# Altium schematic sheet SlowChans.SchDoc
size 594 x 420 mm; Address1: Address1; Address2: Address2; Address3: Address3; Address4: Address4; SheetNumber: 1; Scale: 1:1; Разраб.: Иванов; Обозначение документа: АБВГ.123456.001 Э3; Пров.: Петров; Утв.: Сидоров; Наименование организации: ОАО "Концерн "МПО-Гидроприбор"; Перв. применение: АБВГ.123456.000; Наименование изделия 1: Плата; Наименование изделия 2: Схема электрическая; Наименование изделия 3: принципиальная; Нач. отд.: Нач. отд.; Фамилия нач. отд.: Сидоров
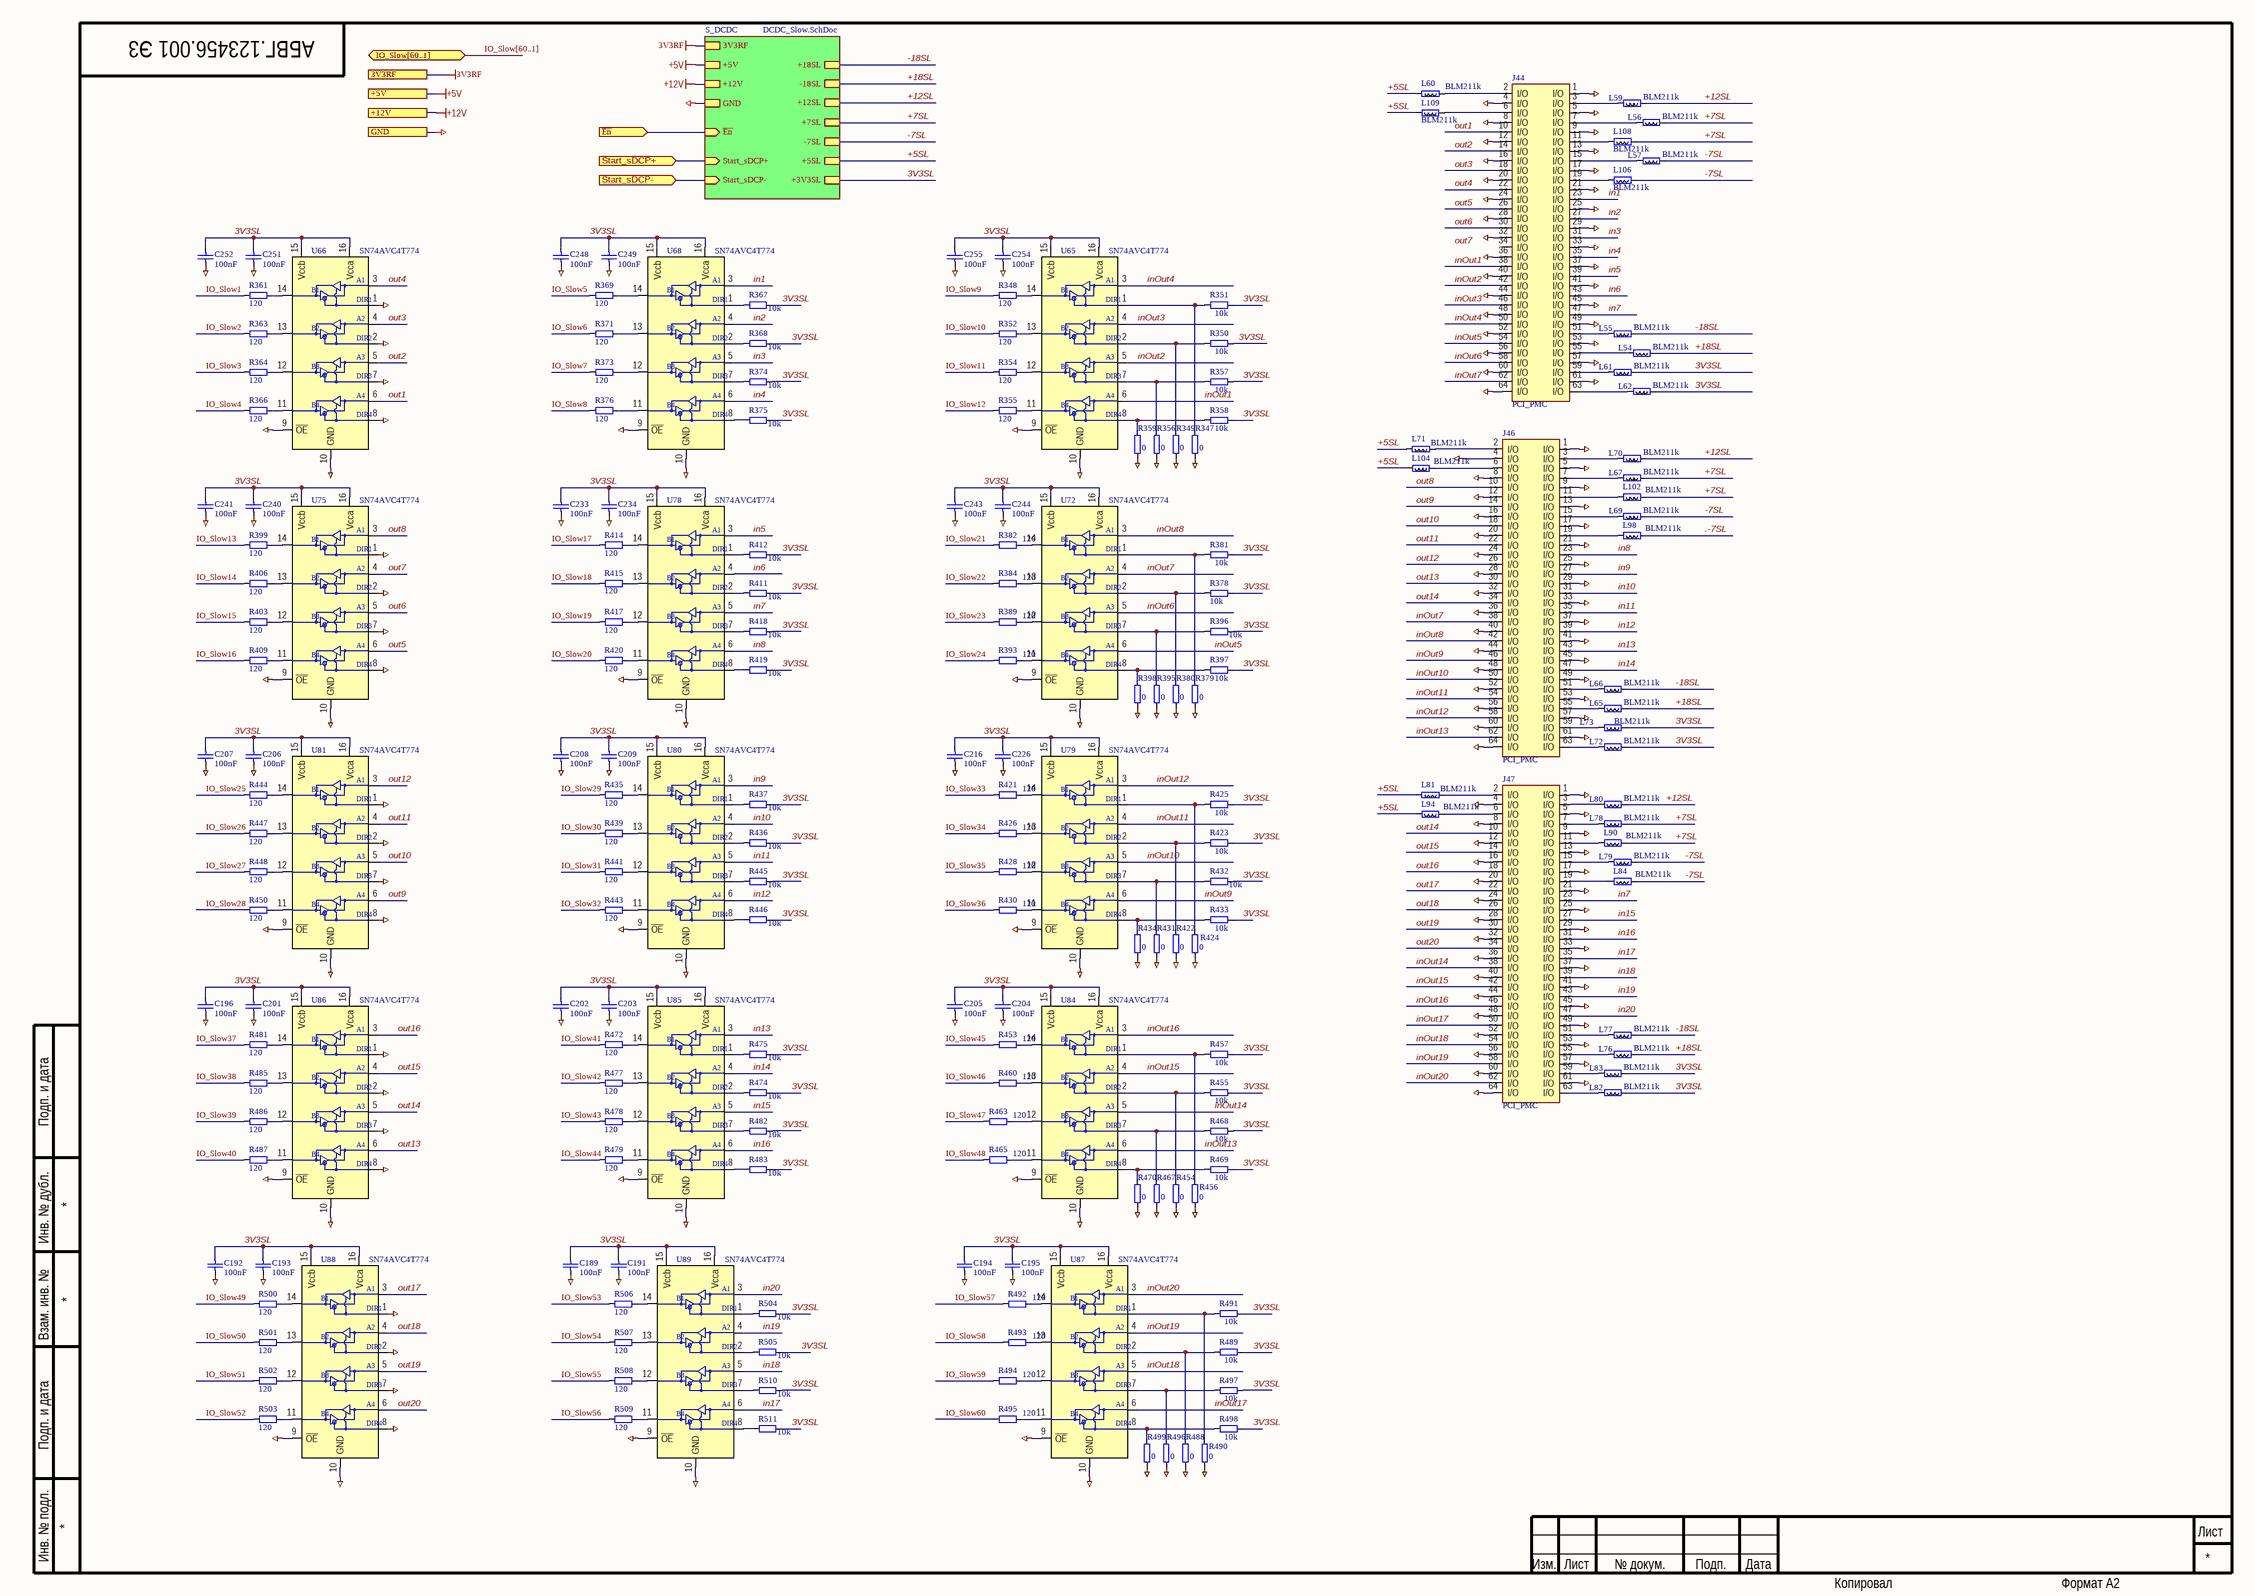
[diagram p0: SlowChans.SchDoc]

## Parts
C189  100nF  [SMD0805CAP]
C191  100nF  [SMD0805CAP]
C192  100nF  [SMD0805CAP]
C193  100nF  [SMD0805CAP]
C194  100nF  [SMD0805CAP]
C195  100nF  [SMD0805CAP]
C196  100nF  [SMD0805CAP]
C201  100nF  [SMD0805CAP]
C202  100nF  [SMD0805CAP]
C203  100nF  [SMD0805CAP]
C204  100nF  [SMD0805CAP]
C205  100nF  [SMD0805CAP]
C206  100nF  [SMD0805CAP]
C207  100nF  [SMD0805CAP]
C208  100nF  [SMD0805CAP]
C209  100nF  [SMD0805CAP]
C216  100nF  [SMD0805CAP]
C226  100nF  [SMD0805CAP]
C233  100nF  [SMD0805CAP]
C234  100nF  [SMD0805CAP]
C240  100nF  [SMD0805CAP]
C241  100nF  [SMD0805CAP]
C243  100nF  [SMD0805CAP]
C244  100nF  [SMD0805CAP]
C248  100nF  [SMD0805CAP]
C249  100nF  [SMD0805CAP]
C251  100nF  [SMD0805CAP]
C252  100nF  [SMD0805CAP]
C254  100nF  [SMD0805CAP]
C255  100nF  [SMD0805CAP]
J44  PCI_PMC  [TYCO_120521-1]
J46  PCI_PMC  [TYCO_120521-1]
J47  PCI_PMC  [TYCO_120521-1]
L54  BLM211k  [RESC2012X50N]
L55  BLM211k  [RESC2012X50N]
L56  BLM211k  [RESC2012X50N]
L57  BLM211k  [RESC2012X50N]
L59  BLM211k  [RESC2012X50N]
L60  BLM211k  [RESC2012X50N]
L61  BLM211k  [RESC2012X50N]
L62  BLM211k  [RESC2012X50N]
L65  BLM211k  [RESC2012X50N]
L66  BLM211k  [RESC2012X50N]
L67  BLM211k  [RESC2012X50N]
L69  BLM211k  [RESC2012X50N]
L70  BLM211k  [RESC2012X50N]
L71  BLM211k  [RESC2012X50N]
L72  BLM211k  [RESC2012X50N]
L73  BLM211k  [RESC2012X50N]
L76  BLM211k  [RESC2012X50N]
L77  BLM211k  [RESC2012X50N]
L78  BLM211k  [RESC2012X50N]
L79  BLM211k  [RESC2012X50N]
L80  BLM211k  [RESC2012X50N]
L81  BLM211k  [RESC2012X50N]
L82  BLM211k  [RESC2012X50N]
L83  BLM211k  [RESC2012X50N]
L84  BLM211k  [RESC2012X50N]
L90  BLM211k  [RESC2012X50N]
L94  BLM211k  [RESC2012X50N]
L98  BLM211k  [RESC2012X50N]
L102  BLM211k  [RESC2012X50N]
L104  BLM211k  [RESC2012X50N]
L106  BLM211k  [RESC2012X50N]
L108  BLM211k  [RESC2012X50N]
L109  BLM211k  [RESC2012X50N]
R347  0  [SMD0805RES]
R348  120  [SMD0805RES]
R349  0  [SMD0805RES]
R350  10k  [SMD0805RES]
R351  10k  [SMD0805RES]
R352  120  [SMD0805RES]
R354  120  [SMD0805RES]
R355  120  [SMD0805RES]
R356  0  [SMD0805RES]
R357  10k  [SMD0805RES]
R358  10k  [SMD0805RES]
R359  0  [SMD0805RES]
R361  120  [SMD0805RES]
R363  120  [SMD0805RES]
R364  120  [SMD0805RES]
R366  120  [SMD0805RES]
R367  10k  [SMD0805RES]
R368  10k  [SMD0805RES]
R369  120  [SMD0805RES]
R371  120  [SMD0805RES]
R373  120  [SMD0805RES]
R374  10k  [SMD0805RES]
R375  10k  [SMD0805RES]
R376  120  [SMD0805RES]
R378  10k  [SMD0805RES]
R379  0  [SMD0805RES]
R380  0  [SMD0805RES]
R381  10k  [SMD0805RES]
R382  120  [SMD0805RES]
R384  120  [SMD0805RES]
R389  120  [SMD0805RES]
R393  120  [SMD0805RES]
R395  0  [SMD0805RES]
R396  10k  [SMD0805RES]
R397  10k  [SMD0805RES]
R398  0  [SMD0805RES]
R399  120  [SMD0805RES]
R403  120  [SMD0805RES]
R406  120  [SMD0805RES]
R409  120  [SMD0805RES]
R411  10k  [SMD0805RES]
R412  10k  [SMD0805RES]
R414  120  [SMD0805RES]
R415  120  [SMD0805RES]
R417  120  [SMD0805RES]
R418  10k  [SMD0805RES]
R419  10k  [SMD0805RES]
R420  120  [SMD0805RES]
R421  120  [SMD0805RES]
R422  0  [SMD0805RES]
R423  10k  [SMD0805RES]
R424  0  [SMD0805RES]
R425  10k  [SMD0805RES]
R426  120  [SMD0805RES]
R428  120  [SMD0805RES]
R430  120  [SMD0805RES]
R431  0  [SMD0805RES]
R432  10k  [SMD0805RES]
R433  10k  [SMD0805RES]
R434  0  [SMD0805RES]
R435  120  [SMD0805RES]
R436  10k  [SMD0805RES]
R437  10k  [SMD0805RES]
R439  120  [SMD0805RES]
R441  120  [SMD0805RES]
R443  120  [SMD0805RES]
R444  120  [SMD0805RES]
R445  10k  [SMD0805RES]
R446  10k  [SMD0805RES]
R447  120  [SMD0805RES]
R448  120  [SMD0805RES]
R450  120  [SMD0805RES]
R453  120  [SMD0805RES]
R454  0  [SMD0805RES]
R455  10k  [SMD0805RES]
R456  0  [SMD0805RES]
R457  10k  [SMD0805RES]
R460  120  [SMD0805RES]
R463  120  [SMD0805RES]
R465  120  [SMD0805RES]
R467  0  [SMD0805RES]
R468  10k  [SMD0805RES]
R469  10k  [SMD0805RES]
R470  0  [SMD0805RES]
R472  120  [SMD0805RES]
R474  10k  [SMD0805RES]
R475  10k  [SMD0805RES]
R477  120  [SMD0805RES]
R478  120  [SMD0805RES]
R479  120  [SMD0805RES]
R481  120  [SMD0805RES]
R482  10k  [SMD0805RES]
R483  10k  [SMD0805RES]
R485  120  [SMD0805RES]
R486  120  [SMD0805RES]
R487  120  [SMD0805RES]
R488  0  [SMD0805RES]
R489  10k  [SMD0805RES]
R490  0  [SMD0805RES]
R491  10k  [SMD0805RES]
R492  120  [SMD0805RES]
R493  120  [SMD0805RES]
R494  120  [SMD0805RES]
R495  120  [SMD0805RES]
R496  0  [SMD0805RES]
R497  10k  [SMD0805RES]
R498  10k  [SMD0805RES]
R499  0  [SMD0805RES]
R500  120  [SMD0805RES]
R501  120  [SMD0805RES]
R502  120  [SMD0805RES]
R503  120  [SMD0805RES]
R504  10k  [SMD0805RES]
R505  10k  [SMD0805RES]
R506  120  [SMD0805RES]
R507  120  [SMD0805RES]
R508  120  [SMD0805RES]
R509  120  [SMD0805RES]
R510  10k  [SMD0805RES]
R511  10k  [SMD0805RES]
U65  SN74AVC4T774  [TSSOP-16]
U66  SN74AVC4T774  [TSSOP-16]
U68  SN74AVC4T774  [TSSOP-16]
U72  SN74AVC4T774  [TSSOP-16]
U75  SN74AVC4T774  [TSSOP-16]
U78  SN74AVC4T774  [TSSOP-16]
U79  SN74AVC4T774  [TSSOP-16]
U80  SN74AVC4T774  [TSSOP-16]
U81  SN74AVC4T774  [TSSOP-16]
U84  SN74AVC4T774  [TSSOP-16]
U85  SN74AVC4T774  [TSSOP-16]
U86  SN74AVC4T774  [TSSOP-16]
U87  SN74AVC4T774  [TSSOP-16]
U88  SN74AVC4T774  [TSSOP-16]
U89  SN74AVC4T774  [TSSOP-16]

## Sub-sheets
S_DCDC = DCDC_Slow.SchDoc: +18SL, -18SL, +12SL, +7SL, +3V3SL, +5SL, -7SL, ~{En} (in), Start_sDCP+ (in), Start_sDCP- (in), +5V, +12V, GND, 3V3RF

## Ports
3V3RF, +5V, +12V, GND, IO_Slow[60..1] (bidir), Start_sDCP+ (in), Start_sDCP- (in), ~{En} (in)

## Nets
3V3RF: port 3V3RF, sheet S_DCDC/3V3RF
+5V: port +5V, sheet S_DCDC/+5V
+12V: port +12V, sheet S_DCDC/+12V
GND: C189.1 C191.1 C192.1 C193.1 C194.1 C195.1 C196.1 C201.1 C202.1 C203.1 C204.1 C205.1 C206.1 C207.1 C208.1 C209.1 C216.1 C226.1 C233.1 C234.1 C240.1 C241.1 C243.1 C244.1 C248.1 C249.1 C251.1 C252.1 C254.1 C255.1 J44.1(I/O) J44.4(I/O) J44.5(I/O) J44.8(I/O) J44.9(I/O) J44.12(I/O) J44.13(I/O) J44.16(I/O) J44.17(I/O) J44.20(I/O) J44.21(I/O) J44.24(I/O) J44.25(I/O) J44.28(I/O) J44.29(I/O) J44.32(I/O) J44.33(I/O) J44.36(I/O) J44.37(I/O) J44.40(I/O) J44.41(I/O) J44.44(I/O) J44.45(I/O) J44.48(I/O) J44.49(I/O) J44.52(I/O) J44.53(I/O) J44.56(I/O) J44.57(I/O) J44.60(I/O) J44.61(I/O) J44.64(I/O) J46.1(I/O) J46.4(I/O) J46.5(I/O) J46.8(I/O) J46.9(I/O) J46.12(I/O) J46.13(I/O) J46.16(I/O) J46.17(I/O) J46.20(I/O) J46.21(I/O) J46.24(I/O) J46.25(I/O) J46.28(I/O) J46.29(I/O) J46.32(I/O) J46.33(I/O) J46.36(I/O) J46.37(I/O) J46.40(I/O) J46.41(I/O) J46.44(I/O) J46.45(I/O) J46.48(I/O) J46.49(I/O) J46.52(I/O) J46.53(I/O) J46.56(I/O) J46.57(I/O) J46.60(I/O) J46.61(I/O) J46.64(I/O) J47.1(I/O) J47.4(I/O) J47.5(I/O) J47.8(I/O) J47.9(I/O) J47.12(I/O) J47.13(I/O) J47.16(I/O) J47.17(I/O) J47.20(I/O) J47.21(I/O) J47.24(I/O) J47.25(I/O) J47.28(I/O) J47.29(I/O) J47.32(I/O) J47.33(I/O) J47.36(I/O) J47.37(I/O) J47.40(I/O) J47.41(I/O) J47.44(I/O) J47.45(I/O) J47.48(I/O) J47.49(I/O) J47.52(I/O) J47.53(I/O) J47.56(I/O) J47.57(I/O) J47.60(I/O) J47.61(I/O) J47.64(I/O) R347.1 R349.2 R356.2 R359.2 R379.1 R380.2 R395.2 R398.2 R422.2 R424.1 R431.2 R434.2 R454.2 R456.1 R467.2 R470.2 R488.2 R490.1 R496.2 R499.2 U65.9(~{OE}) U65.10(GND) U66.1(DIR1) U66.2(DIR2) U66.7(DIR3) U66.8(DIR4) U66.9(~{OE}) U66.10(GND) U68.9(~{OE}) U68.10(GND) U72.9(~{OE}) U72.10(GND) U75.1(DIR1) U75.2(DIR2) U75.7(DIR3) U75.8(DIR4) U75.9(~{OE}) U75.10(GND) U78.9(~{OE}) U78.10(GND) U79.9(~{OE}) U79.10(GND) U80.9(~{OE}) U80.10(GND) U81.1(DIR1) U81.2(DIR2) U81.7(DIR3) U81.8(DIR4) U81.9(~{OE}) U81.10(GND) U84.9(~{OE}) U84.10(GND) U85.9(~{OE}) U85.10(GND) U86.1(DIR1) U86.2(DIR2) U86.7(DIR3) U86.8(DIR4) U86.9(~{OE}) U86.10(GND) U87.9(~{OE}) U87.10(GND) U88.1(DIR1) U88.2(DIR2) U88.7(DIR3) U88.8(DIR4) U88.9(~{OE}) U88.10(GND) U89.9(~{OE}) U89.10(GND) ; port GND, sheet S_DCDC/GND
3V3SL: C189.2 C191.2 C192.2 C193.2 C194.2 C195.2 C196.2 C201.2 C202.2 C203.2 C204.2 C205.2 C206.2 C207.2 C208.2 C209.2 C216.2 C226.2 C233.2 C234.2 C240.2 C241.2 C243.2 C244.2 C248.2 C249.2 C251.2 C252.2 C254.2 C255.2 L61.2 L62.2 L72.2 L73.2 L82.2 L83.2 R350.1 R351.1 R357.1 R358.1 R367.1 R368.1 R374.1 R375.1 R378.1 R381.1 R396.1 R397.1 R411.1 R412.1 R418.1 R419.1 R423.1 R425.1 R432.1 R433.1 R436.1 R437.1 R445.1 R446.1 R455.1 R457.1 R468.1 R469.1 R474.1 R475.1 R482.1 R483.1 R489.1 R491.1 R497.1 R498.1 R504.1 R505.1 R510.1 R511.1 U65.15(Vccb) U65.16(Vcca) U66.15(Vccb) U66.16(Vcca) U68.15(Vccb) U68.16(Vcca) U72.15(Vccb) U72.16(Vcca) U75.15(Vccb) U75.16(Vcca) U78.15(Vccb) U78.16(Vcca) U79.15(Vccb) U79.16(Vcca) U80.15(Vccb) U80.16(Vcca) U81.15(Vccb) U81.16(Vcca) U84.15(Vccb) U84.16(Vcca) U85.15(Vccb) U85.16(Vcca) U86.15(Vccb) U86.16(Vcca) U87.15(Vccb) U87.16(Vcca) U88.15(Vccb) U88.16(Vcca) U89.15(Vccb) U89.16(Vcca) ; sheet S_DCDC/+3V3SL
+5SL: L60.2 L71.2 L81.2 L94.1 L104.1 L109.1 ; sheet S_DCDC/+5SL
+7SL: L56.2 L67.2 L78.2 L90.2 L102.2 L108.2 ; sheet S_DCDC/+7SL
+12SL: L59.2 L70.2 L80.2 ; sheet S_DCDC/+12SL
+18SL: L54.2 L65.2 L76.2 ; sheet S_DCDC/-18SL
-7SL: L57.2 L69.2 L79.2 L84.2 L106.2 ; sheet S_DCDC/-7SL
-18SL: L55.2 L66.2 L77.2 ; sheet S_DCDC/+18SL
.-7SL: L98.2
~{En}: port ~{En}, sheet S_DCDC/~{En}
in1: J44.23(I/O) U68.3(A1)
in2: J44.27(I/O) U68.4(A2)
in3: J44.31(I/O) U68.5(A3)
in4: J44.35(I/O) U68.6(A4)
in5: J44.39(I/O) U78.3(A1)
in6: J44.43(I/O) U78.4(A2)
in7: J44.47(I/O) J47.23(I/O) U78.5(A3)
in8: J46.23(I/O) U78.6(A4)
in9: J46.27(I/O) U80.3(A1)
in10: J46.31(I/O) U80.4(A2)
in11: J46.35(I/O) U80.5(A3)
in12: J46.39(I/O) U80.6(A4)
in13: J46.43(I/O) U85.3(A1)
in14: J46.47(I/O) U85.4(A2)
in15: J47.27(I/O) U85.5(A3)
in16: J47.31(I/O) U85.6(A4)
in17: J47.35(I/O) U89.6(A4)
in18: J47.39(I/O) U89.5(A3)
in19: J47.43(I/O) U89.4(A2)
in20: J47.47(I/O) U89.3(A1)
inOut1: J44.38(I/O) U65.6(A4)
inOut2: J44.42(I/O) U65.5(A3)
inOut3: J44.46(I/O) U65.4(A2)
inOut4: J44.50(I/O) U65.3(A1)
inOut5: J44.54(I/O) U72.6(A4)
inOut6: J44.58(I/O) U72.5(A3)
inOut7: J44.62(I/O) J46.38(I/O) U72.4(A2)
inOut8: J46.42(I/O) U72.3(A1)
inOut9: J46.46(I/O) U79.6(A4)
inOut10: J46.50(I/O) U79.5(A3)
inOut11: J46.54(I/O) U79.4(A2)
inOut12: J46.58(I/O) U79.3(A1)
inOut13: J46.62(I/O) U84.6(A4)
inOut14: J47.38(I/O) U84.5(A3)
inOut15: J47.42(I/O) U84.4(A2)
inOut16: J47.46(I/O) U84.3(A1)
inOut17: J47.50(I/O) U87.6(A4)
inOut18: J47.54(I/O) U87.5(A3)
inOut19: J47.58(I/O) U87.4(A2)
inOut20: J47.62(I/O) U87.3(A1)
IO_Slow1: R361.2
IO_Slow2: R363.2
IO_Slow3: R364.2
IO_Slow4: R366.2
IO_Slow5: R369.2
IO_Slow6: R371.2
IO_Slow7: R373.2
IO_Slow8: R376.2
IO_Slow9: R348.2
IO_Slow10: R352.2
IO_Slow11: R354.2
IO_Slow12: R355.2
IO_Slow13: R399.2
IO_Slow14: R406.2
IO_Slow15: R403.2
IO_Slow16: R409.2
IO_Slow17: R414.2
IO_Slow18: R415.1
IO_Slow19: R417.2
IO_Slow20: R420.2
IO_Slow21: R382.2
IO_Slow22: R384.2
IO_Slow23: R389.2
IO_Slow24: R393.2
IO_Slow25: R444.2
IO_Slow26: R447.2
IO_Slow27: R448.2
IO_Slow28: R450.2
IO_Slow29: R435.2
IO_Slow30: R439.2
IO_Slow31: R441.2
IO_Slow32: R443.2
IO_Slow33: R421.2
IO_Slow34: R426.2
IO_Slow35: R428.2
IO_Slow36: R430.2
IO_Slow37: R481.2
IO_Slow38: R485.2
IO_Slow39: R486.2
IO_Slow40: R487.2
IO_Slow41: R472.2
IO_Slow42: R477.2
IO_Slow43: R478.2
IO_Slow44: R479.2
IO_Slow45: R453.2
IO_Slow46: R460.2
IO_Slow47: R463.2
IO_Slow48: R465.2
IO_Slow49: R500.2
IO_Slow50: R501.2
IO_Slow51: R502.2
IO_Slow52: R503.2
IO_Slow53: R506.2
IO_Slow54: R507.2
IO_Slow55: R508.2
IO_Slow56: R509.2
IO_Slow57: R492.2
IO_Slow58: R493.2
IO_Slow59: R494.2
IO_Slow60: R495.2
out1: J44.10(I/O) U66.6(A4)
out2: J44.14(I/O) U66.5(A3)
out3: J44.18(I/O) U66.4(A2)
out4: J44.22(I/O) U66.3(A1)
out5: J44.26(I/O) U75.6(A4)
out6: J44.30(I/O) U75.5(A3)
out7: U75.4(A2)
out8: J46.10(I/O) U75.3(A1)
out9: J46.14(I/O) U81.6(A4)
out10: J46.18(I/O) U81.5(A3)
out11: J46.22(I/O) U81.4(A2)
out12: J46.26(I/O) U81.3(A1)
out13: J46.30(I/O) U86.6(A4)
out14: J46.34(I/O) J47.10(I/O) U86.5(A3)
out15: J47.14(I/O) U86.4(A2)
out16: J47.18(I/O) U86.3(A1)
out17: J47.22(I/O) U88.3(A1)
out18: J47.26(I/O) U88.4(A2)
out19: J47.30(I/O) U88.5(A3)
out20: J47.34(I/O) U88.6(A4)
Start_sDCP+: port Start_sDCP+, sheet S_DCDC/Start_sDCP+
Start_sDCP-: port Start_sDCP-, sheet S_DCDC/Start_sDCP-
NetJ44_2: J44.2(I/O) L60.1
NetJ44_3: J44.3(I/O) L59.1
NetJ44_6: J44.6(I/O) L109.2
NetJ44_7: J44.7(I/O) L56.1
NetJ44_11: J44.11(I/O) L108.1
NetJ44_15: J44.15(I/O) L57.1
NetJ44_19: J44.19(I/O) L106.1
NetJ44_51: J44.51(I/O) L55.1
NetJ44_55: J44.55(I/O) L54.1
NetJ44_59: J44.59(I/O) L61.1
NetJ44_63: J44.63(I/O) L62.1
NetJ46_2: J46.2(I/O) L71.1
NetJ46_3: J46.3(I/O) L70.1
NetJ46_6: J46.6(I/O) L104.2
NetJ46_7: J46.7(I/O) L67.1
NetJ46_11: J46.11(I/O) L102.1
NetJ46_15: J46.15(I/O) L69.1
NetJ46_19: J46.19(I/O) L98.1
NetJ46_51: J46.51(I/O) L66.1
NetJ46_55: J46.55(I/O) L65.1
NetJ46_59: J46.59(I/O) L73.1
NetJ46_63: J46.63(I/O) L72.1
NetJ47_2: J47.2(I/O) L81.1
NetJ47_3: J47.3(I/O) L80.1
NetJ47_6: J47.6(I/O) L94.2
NetJ47_7: J47.7(I/O) L78.1
NetJ47_11: J47.11(I/O) L90.1
NetJ47_15: J47.15(I/O) L79.1
NetJ47_19: J47.19(I/O) L84.1
NetJ47_51: J47.51(I/O) L77.1
NetJ47_55: J47.55(I/O) L76.1
NetJ47_59: J47.59(I/O) L83.1
NetJ47_63: J47.63(I/O) L82.1
NetR347_2: R347.2 R351.2 U65.1(DIR1)
NetR348_1: R348.1 U65.14(B1)
NetR349_1: R349.1 R350.2 U65.2(DIR2)
NetR352_1: R352.1 U65.13(B2)
NetR354_1: R354.1 U65.12(B3)
NetR355_1: R355.1 U65.11(B4)
NetR356_1: R356.1 R357.2 U65.7(DIR3)
NetR358_2: R358.2 R359.1 U65.8(DIR4)
NetR361_1: R361.1 U66.14(B1)
NetR363_1: R363.1 U66.13(B2)
NetR364_1: R364.1 U66.12(B3)
NetR366_1: R366.1 U66.11(B4)
NetR367_2: R367.2 U68.1(DIR1)
NetR368_2: R368.2 U68.2(DIR2)
NetR369_1: R369.1 U68.14(B1)
NetR371_1: R371.1 U68.13(B2)
NetR373_1: R373.1 U68.12(B3)
NetR374_2: R374.2 U68.7(DIR3)
NetR375_2: R375.2 U68.8(DIR4)
NetR376_1: R376.1 U68.11(B4)
NetR378_2: R378.2 R380.1 U72.2(DIR2)
NetR379_2: R379.2 R381.2 U72.1(DIR1)
NetR382_1: R382.1 U72.14(B1)
NetR384_1: R384.1 U72.13(B2)
NetR389_1: R389.1 U72.12(B3)
NetR393_1: R393.1 U72.11(B4)
NetR395_1: R395.1 R396.2 U72.7(DIR3)
NetR397_2: R397.2 R398.1 U72.8(DIR4)
NetR399_1: R399.1 U75.14(B1)
NetR403_1: R403.1 U75.12(B3)
NetR406_1: R406.1 U75.13(B2)
NetR409_1: R409.1 U75.11(B4)
NetR411_2: R411.2 U78.2(DIR2)
NetR412_2: R412.2 U78.1(DIR1)
NetR414_1: R414.1 U78.14(B1)
NetR415_2: R415.2 U78.13(B2)
NetR417_1: R417.1 U78.12(B3)
NetR418_2: R418.2 U78.7(DIR3)
NetR419_2: R419.2 U78.8(DIR4)
NetR420_1: R420.1 U78.11(B4)
NetR421_1: R421.1 U79.14(B1)
NetR422_1: R422.1 R423.2 U79.2(DIR2)
NetR424_2: R424.2 R425.2 U79.1(DIR1)
NetR426_1: R426.1 U79.13(B2)
NetR428_1: R428.1 U79.12(B3)
NetR430_1: R430.1 U79.11(B4)
NetR431_1: R431.1 R432.2 U79.7(DIR3)
NetR433_2: R433.2 R434.1 U79.8(DIR4)
NetR435_1: R435.1 U80.14(B1)
NetR436_2: R436.2 U80.2(DIR2)
NetR437_2: R437.2 U80.1(DIR1)
NetR439_1: R439.1 U80.13(B2)
NetR441_1: R441.1 U80.12(B3)
NetR443_1: R443.1 U80.11(B4)
NetR444_1: R444.1 U81.14(B1)
NetR445_2: R445.2 U80.7(DIR3)
NetR446_2: R446.2 U80.8(DIR4)
NetR447_1: R447.1 U81.13(B2)
NetR448_1: R448.1 U81.12(B3)
NetR450_1: R450.1 U81.11(B4)
NetR453_1: R453.1 U84.14(B1)
NetR454_1: R454.1 R455.2 U84.2(DIR2)
NetR456_2: R456.2 R457.2 U84.1(DIR1)
NetR460_1: R460.1 U84.13(B2)
NetR463_1: R463.1 U84.12(B3)
NetR465_1: R465.1 U84.11(B4)
NetR467_1: R467.1 R468.2 U84.7(DIR3)
NetR469_2: R469.2 R470.1 U84.8(DIR4)
NetR472_1: R472.1 U85.14(B1)
NetR474_2: R474.2 U85.2(DIR2)
NetR475_2: R475.2 U85.1(DIR1)
NetR477_1: R477.1 U85.13(B2)
NetR478_1: R478.1 U85.12(B3)
NetR479_1: R479.1 U85.11(B4)
NetR481_1: R481.1 U86.14(B1)
NetR482_2: R482.2 U85.7(DIR3)
NetR483_2: R483.2 U85.8(DIR4)
NetR485_1: R485.1 U86.13(B2)
NetR486_1: R486.1 U86.12(B3)
NetR487_1: R487.1 U86.11(B4)
NetR488_1: R488.1 R489.2 U87.2(DIR2)
NetR490_2: R490.2 R491.2 U87.1(DIR1)
NetR492_1: R492.1 U87.14(B1)
NetR493_1: R493.1 U87.13(B2)
NetR494_1: R494.1 U87.12(B3)
NetR495_1: R495.1 U87.11(B4)
NetR496_1: R496.1 R497.2 U87.7(DIR3)
NetR498_2: R498.2 R499.1 U87.8(DIR4)
NetR500_1: R500.1 U88.14(B1)
NetR501_1: R501.1 U88.13(B2)
NetR502_1: R502.1 U88.12(B3)
NetR503_1: R503.1 U88.11(B4)
NetR504_2: R504.2 U89.1(DIR1)
NetR505_2: R505.2 U89.2(DIR2)
NetR506_1: R506.1 U89.14(B1)
NetR507_1: R507.1 U89.13(B2)
NetR508_1: R508.1 U89.12(B3)
NetR509_1: R509.1 U89.11(B4)
NetR510_2: R510.2 U89.7(DIR3)
NetR511_2: R511.2 U89.8(DIR4)

Not connected (* = marked no-connect by the designer): J44 34(I/O)

## Buses and harness runs
bus IO_Slow[60..1] = port IO_Slow[60..1]

## Notes on the sheet
- Labels drawn without touching a wire or pin: out7
- Подп. и дата
- Инв. № дубл.
- Взам. инв. №
- Инв. № подл.
- Изм.
- Лист
- № докум.
- Подп.
- Дата
- Копировал
- Формат А2

## Library data of the parts
C189 C191-C196 C201-C209 C216 C226 C233 C234 C240 C241 C243 C244 C248 C249 C251 C252 C254 C255 = C0805: Чип конденсатор 0805; Voltage: 25V; Vendor: Vishay; DielectricType: X5R; SMD Solders: 2; Solder Option: RM; Tolerance: 20%; Pkg: SMD0805; Device: Cap0805; Value: 100nF; Price: 2
J44 J46 J47 = PCI_PMC_M: PCI Mezzanine Connector; IEEE 1386 MainBoard; Manufactuer: TE Connectivity; PartField: 120527-1; SolderOption: 2; Pkg: PMC Male (IEEE 1386); Value: PCI_PMC; Vendor: TE Connectivity
L54-L57 L59-L62 L65-L67 L69-L73 L76-L84 L90 L94 L98 L102 L104 L106 L108 L109 = BLM21: SMD Ferrite bead 0805; Vendor: Vishay; Value: 1k; Pkg: SMD0805; SMD Solders: 2; Solder Option: RM; Price: 10; Device: BLM21
R347-R352 R354-R359 R361 R363 R364 R366-R369 R371 R373-R376 R378-R382 R384 R389 R393 R395-R399 R403 R406 R409 R411 R412 R414 R417-R426 R428 R430-R437 R439 R441 R443-R448 R450 R453-R457 R460 R463 R465 R467-R470 R472 R474 R475 R477-R479 R481-R483 R485-R511 = R0805: Чип резистор 0805; Vendor: Vishay; SMD Solders: 2; Solder Option: i; TC: 100ppm/C; Tolerance: 1%; Pkg: SMD0805; Pwr: 125mW; Device: Res0805; Price: 2
  R347 R349 R356 R359 R379 R380 R395 R398 R422 R424 R431 R434 R454 R456 R467 R470 R488 R490 R496 R499: Value: 0
  R348 R352 R354 R355 R361 R363 R364 R366 R369 R371 R373 R376 R382 R384 R389 R393 R399 R403 R406 R409 R414 R417 R420 R421 R426 R428 R430 R435 R439 R441 R443 R444 R447 R448 R450 R453 R460 R463 R465 R472 R477-R479 R481 R485-R487 R492-R495 R500-R503 R506-R509: Value: 120
  R350 R351 R357 R358 R367 R368 R374 R375 R378 R381 R396 R397 R411 R412 R418 R419 R423 R425 R432 R433 R436 R437 R445 R446 R455 R457 R468 R469 R474 R475 R482 R483 R489 R491 R497 R498 R504 R505 R510 R511: Value: 10k
R415 = R0805: Чип резистор 0805; Vendor: Vishay; SMD Solders: 2; Solder Option: RM; TC: 100ppm/C; Tolerance: 1%; Pkg: SMD0805; Pwr: 125mW; Device: Res0805; Price: 2; Value: 120
U65 U66 U68 U72 U75 U78-U81 U84-U89 = SN74AVC4T774: Двунаправленный буфер; Pkg: TSSOP16; SMD Solders: 16; Solder Option: RM; THD Solders: 0; Vendor: Texas Instruments; Voltage: 1V1.. 3.6V  I/Os are 4.6-V Tolerant; Name to order: SN74AVC4T774PW; Device: SN74AVC4T774; Price: 300